# Altium project ANE_0002_01AA.PrjPCB (part 1 of 4)
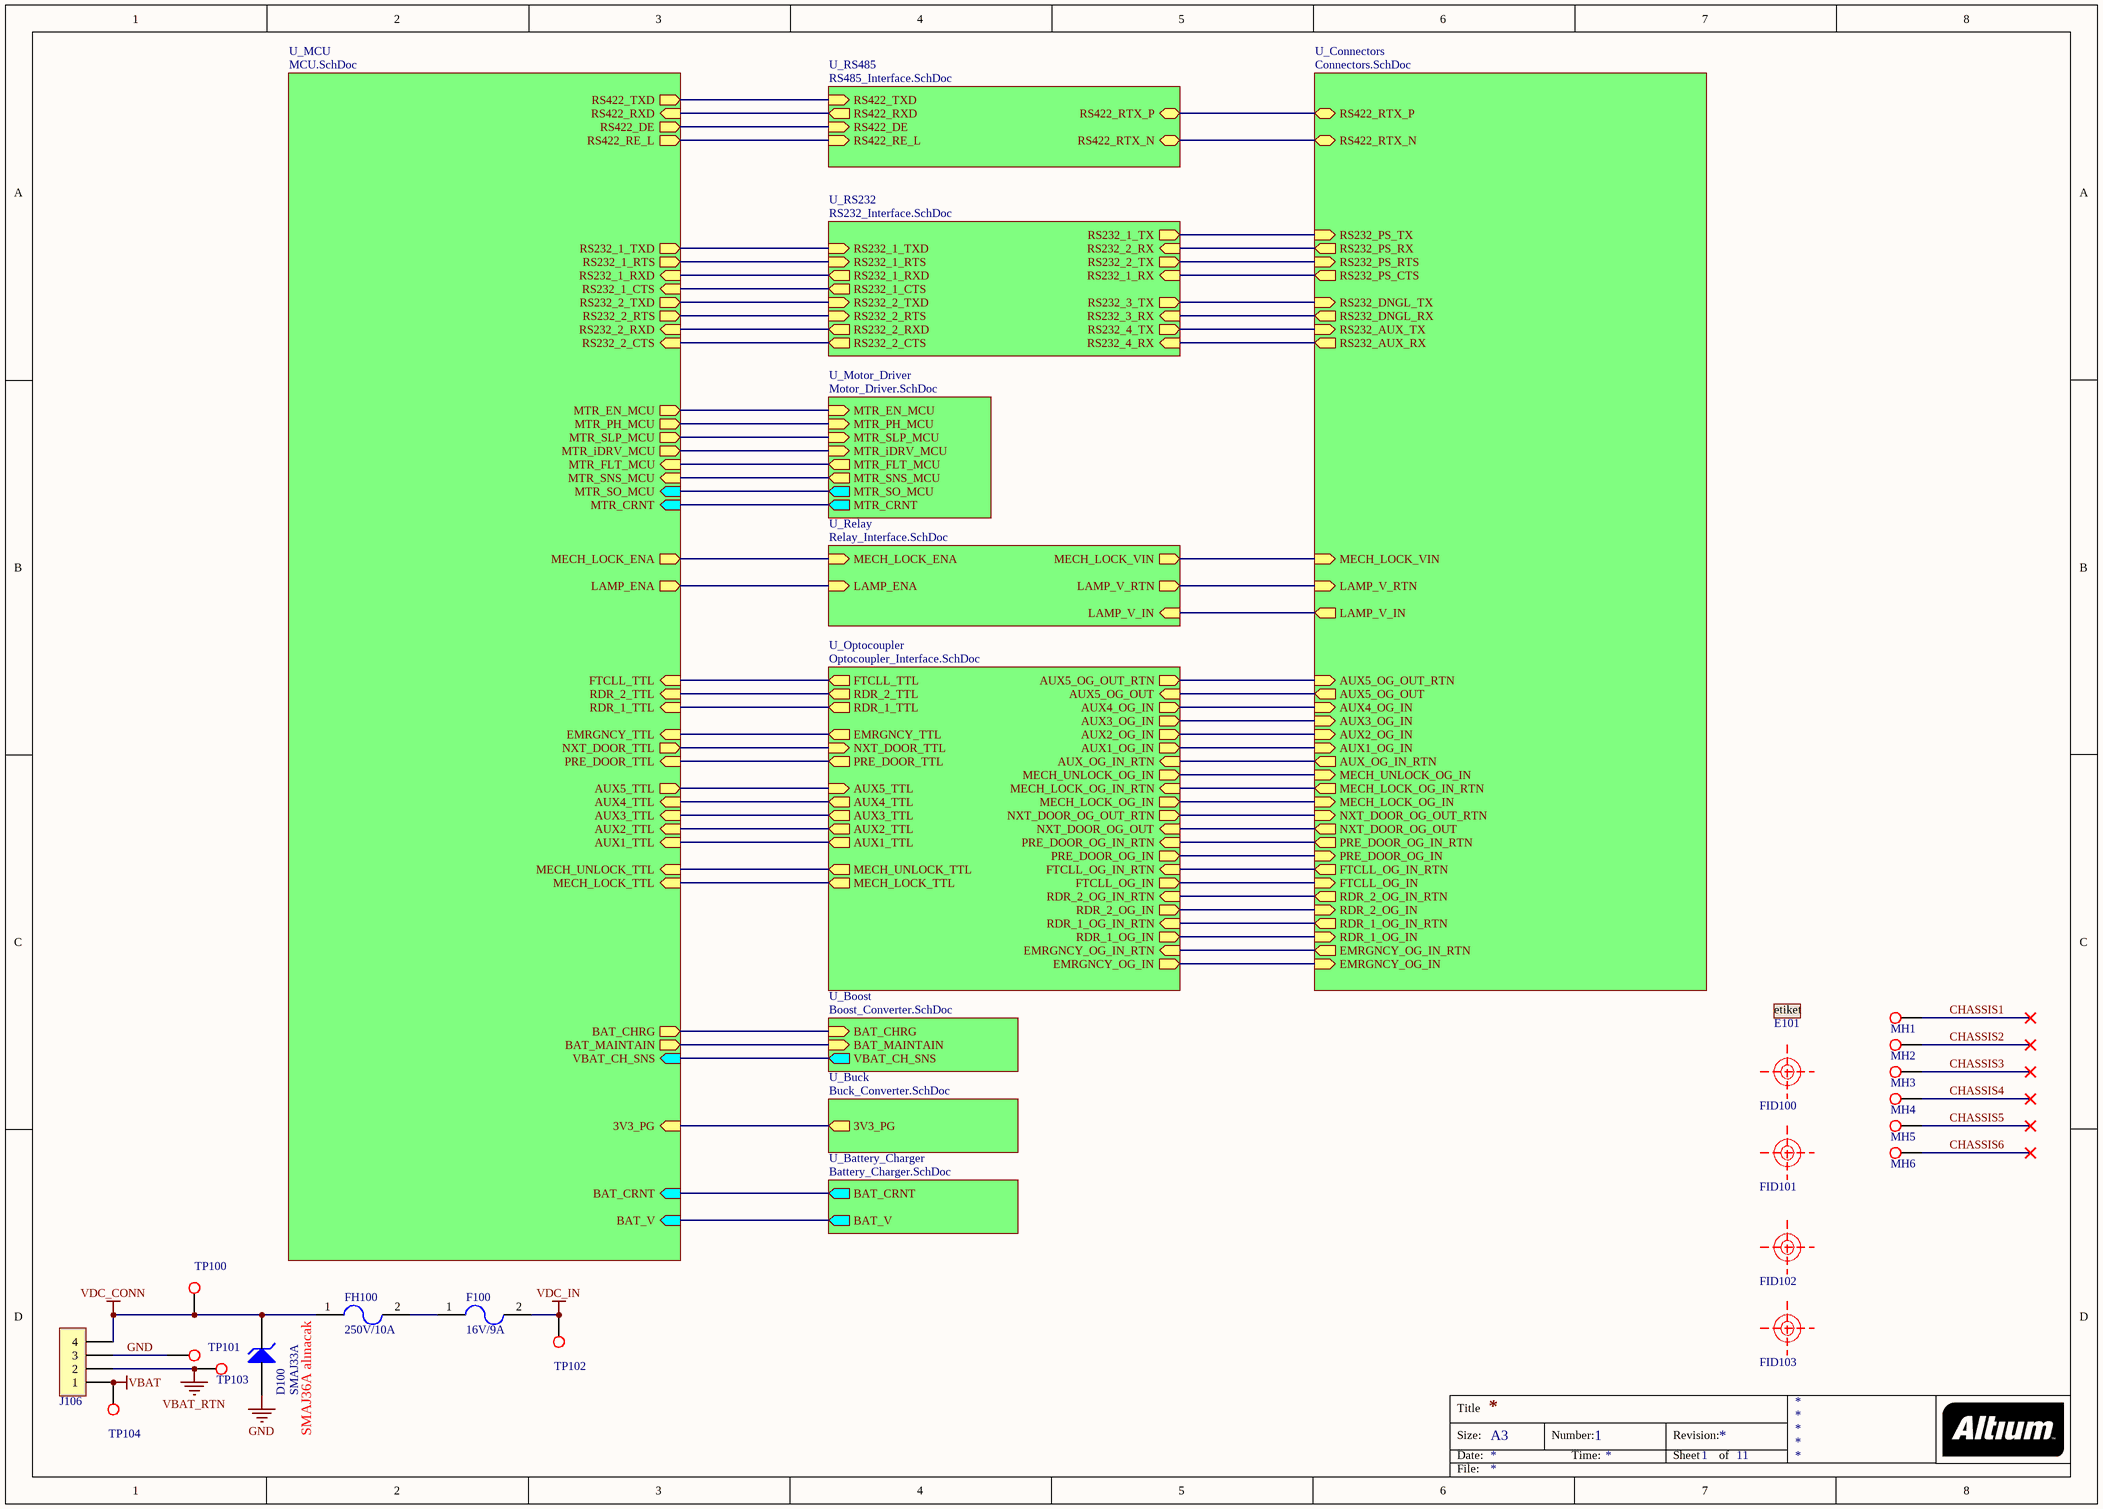
[diagram p0: Main.SchDoc]
PCBDegisiklikTarihi: 20.09.2013; Ortam: Altium Designer 13.2.5; OlusturmaTarihi: 08.11.2013; KullanilanDil: TR; GizlilikSinifi: HÝZMETE ÖZEL; DegistirmeTarihi: 21.01.2014; DegisiklikNumarasi: AC; Bolum: Artron/Donaným; ArtronProjeNumarasi: AB00-0006-01AC-0000
11 sheets, 376 parts. Net scope: hierarchical (ports join the sheet entries above them; power ports are global).
Board file: ANE_0002_01AA_0000.PcbDoc
Sheets:
  Main.SchDoc
    U_Motor_Driver = Motor_Driver.SchDoc
    U_RS232 = RS232_Interface.SchDoc
    U_RS485 = RS485_Interface.SchDoc
    U_Optocoupler = Optocoupler_Interface.SchDoc
    U_MCU = MCU.SchDoc
    U_Relay = Relay_Interface.SchDoc
    U_Boost = Boost_Converter.SchDoc
    U_Buck = Buck_Converter.SchDoc
    U_Connectors = Connectors.SchDoc
    U_Battery_Charger = Battery_Charger.SchDoc

## Sheet Main.SchDoc
size A3; DocumentNumber: 1; SheetNumber: 1; SheetTotal: 11

### Parts
D100  SMAJ33A  [DIOM5226X23N]
E101  14x07 mm  [AEME-1407-0000-N000]  (value not drawn)
F100  16V/9A  [AE12-000M-T000-9090]
FH100  250V/10A  [AE15-000T-0000-0001]
FID100  Fiducial  [FIDUCIAL_R1MM0]  (value not drawn)
FID101  Fiducial  [FIDUCIAL_R1MM0]  (value not drawn)
FID102  Fiducial  [FIDUCIAL_R1MM0]  (value not drawn)
FID103  Fiducial  [FIDUCIAL_R1MM0]  (value not drawn)
J106  (no value)  [AJ61-1004-TAPR-RNS0]
MH1  AEMT-C00S-1000-0000  [TP100]  (value not drawn)
MH2  AEMT-C00S-1000-0000  [TP100]  (value not drawn)
MH3  AEMT-C00S-1000-0000  [TP100]  (value not drawn)
MH4  AEMT-C00S-1000-0000  [TP100]  (value not drawn)
MH5  AEMT-C00S-1000-0000  [TP100]  (value not drawn)
MH6  AEMT-C00S-1000-0000  [TP100]  (value not drawn)
TP100  AEMT-C00S-1000-0000  [TP100]  (value not drawn)
TP101  AEMT-C00S-1000-0000  [TP100]  (value not drawn)
TP102  AEMT-C00S-1000-0000  [TP100]  (value not drawn)
TP103  AEMT-C00S-1000-0000  [TP100]  (value not drawn)
TP104  AEMT-C00S-1000-0000  [TP100]  (value not drawn)

### Sub-sheets
U_Battery_Charger = Battery_Charger.SchDoc: BAT_CRNT (out), BAT_V (out)
U_Boost = Boost_Converter.SchDoc: BAT_CHRG (in), BAT_MAINTAIN (in), VBAT_CH_SNS (out)
U_Buck = Buck_Converter.SchDoc: 3V3_PG (out)
U_Connectors = Connectors.SchDoc: RS232_DNGL_TX (in), RS232_DNGL_RX (out), RS232_PS_TX (in), RS232_PS_RX (out), RS232_PS_CTS (out), RS232_PS_RTS (in), MECH_LOCK_VIN (in), MECH_LOCK_OG_IN (in), MECH_LOCK_OG_IN_RTN (out), MECH_UNLOCK_OG_IN (in), EMRGNCY_OG_IN (in), EMRGNCY_OG_IN_RTN (out), PRE_DOOR_OG_IN (in), PRE_DOOR_OG_IN_RTN (out), NXT_DOOR_OG_OUT (out), NXT_DOOR_OG_OUT_RTN (in), RDR_1_OG_IN (in), RDR_1_OG_IN_RTN (out), RDR_2_OG_IN (in), RDR_2_OG_IN_RTN (out), FTCLL_OG_IN (in), FTCLL_OG_IN_RTN (out), LAMP_V_RTN (in), LAMP_V_IN (out), AUX1_OG_IN (in), AUX_OG_IN_RTN (out), AUX2_OG_IN (in), AUX3_OG_IN (in), AUX4_OG_IN (in), AUX5_OG_OUT (out), AUX5_OG_OUT_RTN (in), RS422_RTX_P (bidir), RS422_RTX_N (bidir), RS232_AUX_TX (in), RS232_AUX_RX (out)
U_MCU = MCU.SchDoc: MECH_LOCK_ENA (out), LAMP_ENA (out), EMRGNCY_TTL (in), RDR_1_TTL (in), RDR_2_TTL (in), FTCLL_TTL (in), AUX1_TTL (in), AUX2_TTL (in), AUX3_TTL (in), PRE_DOOR_TTL (in), NXT_DOOR_TTL (out), MECH_LOCK_TTL (in), MECH_UNLOCK_TTL (in), AUX4_TTL (in), AUX5_TTL (out), MTR_EN_MCU (out), MTR_PH_MCU (out), MTR_SLP_MCU (out), MTR_iDRV_MCU (out), MTR_FLT_MCU (in), MTR_SNS_MCU (in), MTR_SO_MCU (in), MTR_CRNT (in), RS232_1_TXD (out), RS232_1_RTS (out), RS232_1_RXD (in), RS232_1_CTS (in), RS422_TXD (out), RS422_RXD (in), RS422_DE (out), RS422_RE_L (out), BAT_CHRG (out), BAT_MAINTAIN (out), VBAT_CH_SNS (in), BAT_CRNT (in), BAT_V (in), 3V3_PG (in), RS232_2_CTS (in), RS232_2_RXD (in), RS232_2_RTS (out), RS232_2_TXD (out)
U_Motor_Driver = Motor_Driver.SchDoc: MTR_EN_MCU (in), MTR_PH_MCU (in), MTR_SLP_MCU (in), MTR_iDRV_MCU (in), MTR_FLT_MCU (out), MTR_SNS_MCU (out), MTR_SO_MCU (out), MTR_CRNT (out)
U_Optocoupler = Optocoupler_Interface.SchDoc: EMRGNCY_OG_IN (out), EMRGNCY_OG_IN_RTN (in), RDR_1_OG_IN (out), RDR_1_OG_IN_RTN (in), RDR_2_OG_IN (out), RDR_2_OG_IN_RTN (in), FTCLL_OG_IN (out), FTCLL_OG_IN_RTN (in), PRE_DOOR_OG_IN (out), PRE_DOOR_OG_IN_RTN (in), NXT_DOOR_OG_OUT (in), NXT_DOOR_OG_OUT_RTN (out), MECH_LOCK_OG_IN (out), MECH_LOCK_OG_IN_RTN (in), PRE_DOOR_TTL (out), NXT_DOOR_TTL (in), MECH_LOCK_TTL (out), EMRGNCY_TTL (out), RDR_1_TTL (out), RDR_2_TTL (out), FTCLL_TTL (out), MECH_UNLOCK_OG_IN (out), MECH_UNLOCK_TTL (out), AUX1_OG_IN (out), AUX_OG_IN_RTN (in), AUX1_TTL (out), AUX2_OG_IN (out), AUX2_TTL (out), AUX3_OG_IN (out), AUX3_TTL (out), AUX4_OG_IN (out), AUX4_TTL (out), AUX5_OG_OUT (in), AUX5_OG_OUT_RTN (out), AUX5_TTL (in)
U_Relay = Relay_Interface.SchDoc: MECH_LOCK_VIN (out), MECH_LOCK_ENA (in), LAMP_V_RTN (out), LAMP_ENA (in), LAMP_V_IN (in)
U_RS232 = RS232_Interface.SchDoc: RS232_1_TX (out), RS232_2_TX (out), RS232_1_RX (in), RS232_2_RX (in), RS232_1_TXD (in), RS232_1_RTS (in), RS232_1_RXD (out), RS232_1_CTS (out), RS232_3_TX (out), RS232_4_TX (out), RS232_3_RX (in), RS232_4_RX (in), RS232_2_TXD (in), RS232_2_RTS (in), RS232_2_RXD (out), RS232_2_CTS (out)
U_RS485 = RS485_Interface.SchDoc: RS422_TXD (in), RS422_RXD (out), RS422_DE (in), RS422_RE_L (in), RS422_RTX_P (bidir), RS422_RTX_N (bidir)

### Nets
GND: D100.2(A) J106.3 TP101.1
VBAT: J106.1 TP104.1
VBAT_RTN: J106.2 TP103.1
VDC_CONN: D100.1(K) FH100.1 J106.4 TP100.1
VDC_IN: F100.2 TP102.1
3V3_PG: sheet U_MCU/3V3_PG, sheet U_Buck/3V3_PG
AUX1_OG_IN: sheet U_Optocoupler/AUX1_OG_IN, sheet U_Connectors/AUX1_OG_IN
AUX1_TTL: sheet U_Optocoupler/AUX1_TTL, sheet U_MCU/AUX1_TTL
AUX2_OG_IN: sheet U_Optocoupler/AUX2_OG_IN, sheet U_Connectors/AUX2_OG_IN
AUX2_TTL: sheet U_Optocoupler/AUX2_TTL, sheet U_MCU/AUX2_TTL
AUX3_OG_IN: sheet U_Optocoupler/AUX3_OG_IN, sheet U_Connectors/AUX3_OG_IN
AUX3_TTL: sheet U_Optocoupler/AUX3_TTL, sheet U_MCU/AUX3_TTL
AUX4_OG_IN: sheet U_Optocoupler/AUX4_OG_IN, sheet U_Connectors/AUX4_OG_IN
AUX4_TTL: sheet U_Optocoupler/AUX4_TTL, sheet U_MCU/AUX4_TTL
AUX5_TTL: sheet U_Optocoupler/AUX5_TTL, sheet U_MCU/AUX5_TTL
AUX_OG_IN_RTN: sheet U_Optocoupler/AUX_OG_IN_RTN, sheet U_Connectors/AUX_OG_IN_RTN
BAT_CHRG: sheet U_MCU/BAT_CHRG, sheet U_Boost/BAT_CHRG
BAT_CRNT: sheet U_MCU/BAT_CRNT, sheet U_Battery_Charger/BAT_CRNT
BAT_MAINTAIN: sheet U_MCU/BAT_MAINTAIN, sheet U_Boost/BAT_MAINTAIN
BAT_V: sheet U_MCU/BAT_V, sheet U_Battery_Charger/BAT_V
CHASSIS1: MH1.1
CHASSIS2: MH2.1
CHASSIS3: MH3.1
CHASSIS4: MH4.1
CHASSIS5: MH5.1
CHASSIS6: MH6.1
EMRGNCY_OG_IN: sheet U_Optocoupler/EMRGNCY_OG_IN, sheet U_Connectors/EMRGNCY_OG_IN
EMRGNCY_TTL: sheet U_Optocoupler/EMRGNCY_TTL, sheet U_MCU/EMRGNCY_TTL
FTCLL_OG_IN: sheet U_Optocoupler/FTCLL_OG_IN, sheet U_Connectors/FTCLL_OG_IN
FTCLL_TTL: sheet U_Optocoupler/FTCLL_TTL, sheet U_MCU/FTCLL_TTL
LAMP_ENA: sheet U_MCU/LAMP_ENA, sheet U_Relay/LAMP_ENA
MECH_LOCK_ENA: sheet U_MCU/MECH_LOCK_ENA, sheet U_Relay/MECH_LOCK_ENA
MECH_LOCK_TTL: sheet U_Optocoupler/MECH_LOCK_TTL, sheet U_MCU/MECH_LOCK_TTL
MECH_UNLOCK_OG_IN: sheet U_Optocoupler/MECH_UNLOCK_OG_IN, sheet U_Connectors/MECH_UNLOCK_OG_IN
MECH_UNLOCK_TTL: sheet U_Optocoupler/MECH_UNLOCK_TTL, sheet U_MCU/MECH_UNLOCK_TTL
MTR_CRNT: sheet U_Motor_Driver/MTR_CRNT, sheet U_MCU/MTR_CRNT
MTR_EN_MCU: sheet U_Motor_Driver/MTR_EN_MCU, sheet U_MCU/MTR_EN_MCU
MTR_FLT_MCU: sheet U_Motor_Driver/MTR_FLT_MCU, sheet U_MCU/MTR_FLT_MCU
MTR_iDRV_MCU: sheet U_Motor_Driver/MTR_iDRV_MCU, sheet U_MCU/MTR_iDRV_MCU
MTR_PH_MCU: sheet U_Motor_Driver/MTR_PH_MCU, sheet U_MCU/MTR_PH_MCU
MTR_SLP_MCU: sheet U_Motor_Driver/MTR_SLP_MCU, sheet U_MCU/MTR_SLP_MCU
MTR_SNS_MCU: sheet U_Motor_Driver/MTR_SNS_MCU, sheet U_MCU/MTR_SNS_MCU
MTR_SO_MCU: sheet U_Motor_Driver/MTR_SO_MCU, sheet U_MCU/MTR_SO_MCU
NXT_DOOR_TTL: sheet U_Optocoupler/NXT_DOOR_TTL, sheet U_MCU/NXT_DOOR_TTL
PRE_DOOR_OG_IN: sheet U_Optocoupler/PRE_DOOR_OG_IN, sheet U_Connectors/PRE_DOOR_OG_IN
PRE_DOOR_TTL: sheet U_Optocoupler/PRE_DOOR_TTL, sheet U_MCU/PRE_DOOR_TTL
RDR_1_OG_IN: sheet U_Optocoupler/RDR_1_OG_IN, sheet U_Connectors/RDR_1_OG_IN
RDR_1_TTL: sheet U_Optocoupler/RDR_1_TTL, sheet U_MCU/RDR_1_TTL
RDR_2_OG_IN: sheet U_Optocoupler/RDR_2_OG_IN, sheet U_Connectors/RDR_2_OG_IN
RDR_2_TTL: sheet U_Optocoupler/RDR_2_TTL, sheet U_MCU/RDR_2_TTL
RS232_1_CTS: sheet U_RS232/RS232_1_CTS, sheet U_MCU/RS232_1_CTS
RS232_1_RTS: sheet U_RS232/RS232_1_RTS, sheet U_MCU/RS232_1_RTS
RS232_1_RX: sheet U_RS232/RS232_1_RX, sheet U_Connectors/RS232_PS_CTS
RS232_1_RXD: sheet U_RS232/RS232_1_RXD, sheet U_MCU/RS232_1_RXD
RS232_1_TX: sheet U_RS232/RS232_1_TX, sheet U_Connectors/RS232_PS_TX
RS232_1_TXD: sheet U_RS232/RS232_1_TXD, sheet U_MCU/RS232_1_TXD
RS232_2_CTS: sheet U_RS232/RS232_2_CTS, sheet U_MCU/RS232_2_CTS
RS232_2_RTS: sheet U_RS232/RS232_2_RTS, sheet U_MCU/RS232_2_RTS
RS232_2_RX: sheet U_RS232/RS232_2_RX, sheet U_Connectors/RS232_PS_RX
RS232_2_RXD: sheet U_RS232/RS232_2_RXD, sheet U_MCU/RS232_2_RXD
RS232_2_TX: sheet U_RS232/RS232_2_TX, sheet U_Connectors/RS232_PS_RTS
RS232_2_TXD: sheet U_RS232/RS232_2_TXD, sheet U_MCU/RS232_2_TXD
RS232_3_RX: sheet U_RS232/RS232_3_RX, sheet U_Connectors/RS232_DNGL_RX
RS232_3_TX: sheet U_RS232/RS232_3_TX, sheet U_Connectors/RS232_DNGL_TX
RS232_4_RX: sheet U_RS232/RS232_4_RX, sheet U_Connectors/RS232_AUX_RX
RS232_4_TX: sheet U_RS232/RS232_4_TX, sheet U_Connectors/RS232_AUX_TX
RS422_DE: sheet U_RS485/RS422_DE, sheet U_MCU/RS422_DE
RS422_RE_L: sheet U_RS485/RS422_RE_L, sheet U_MCU/RS422_RE_L
RS422_RTX_N: sheet U_RS485/RS422_RTX_N, sheet U_Connectors/RS422_RTX_N
RS422_RTX_P: sheet U_RS485/RS422_RTX_P, sheet U_Connectors/RS422_RTX_P
RS422_RXD: sheet U_RS485/RS422_RXD, sheet U_MCU/RS422_RXD
RS422_TXD: sheet U_RS485/RS422_TXD, sheet U_MCU/RS422_TXD
VBAT_CH_SNS: sheet U_MCU/VBAT_CH_SNS, sheet U_Boost/VBAT_CH_SNS
NetD503_3: sheet U_Optocoupler/MECH_LOCK_OG_IN, sheet U_Connectors/MECH_LOCK_OG_IN
NetF100_1: F100.1 FH100.2
NetJ100_2: sheet U_Optocoupler/FTCLL_OG_IN_RTN, sheet U_Connectors/FTCLL_OG_IN_RTN
NetJ100_5: sheet U_Optocoupler/RDR_1_OG_IN_RTN, sheet U_Connectors/RDR_1_OG_IN_RTN
NetJ100_8: sheet U_Optocoupler/RDR_2_OG_IN_RTN, sheet U_Connectors/RDR_2_OG_IN_RTN
NetJ101_1: sheet U_Relay/LAMP_V_IN, sheet U_Connectors/LAMP_V_IN
NetJ101_2: sheet U_Relay/LAMP_V_RTN, sheet U_Connectors/LAMP_V_RTN
NetJ101_9: sheet U_Optocoupler/AUX5_OG_OUT_RTN, sheet U_Connectors/AUX5_OG_OUT_RTN
NetJ101_10: sheet U_Optocoupler/AUX5_OG_OUT, sheet U_Connectors/AUX5_OG_OUT
NetJ102_1: sheet U_Relay/MECH_LOCK_VIN, sheet U_Connectors/MECH_LOCK_VIN
NetJ102_4: sheet U_Optocoupler/MECH_LOCK_OG_IN_RTN, sheet U_Connectors/MECH_LOCK_OG_IN_RTN
NetJ102_7: sheet U_Optocoupler/EMRGNCY_OG_IN_RTN, sheet U_Connectors/EMRGNCY_OG_IN_RTN
NetJ102_9: sheet U_Optocoupler/PRE_DOOR_OG_IN_RTN, sheet U_Connectors/PRE_DOOR_OG_IN_RTN
NetJ102_10: sheet U_Optocoupler/NXT_DOOR_OG_OUT_RTN, sheet U_Connectors/NXT_DOOR_OG_OUT_RTN
NetJ102_11: sheet U_Optocoupler/NXT_DOOR_OG_OUT, sheet U_Connectors/NXT_DOOR_OG_OUT

### Notes on the sheet
- SMAJ36A alınacak
- Title
- Size:
- Date:
- A3
- Number:
- Time:
- Revision:
- Sheet
- of
- File:
- (in symbol AEME-1407-0000-N000) etiket

### Library data of the parts
D100 = AS1H-975M-SI60-0001: Diode, TVS, 3.5V @35A, 33V, 400W,  Uni-directional, DO-214AC; Manufacturer Part Number: SMAJ33A-13-F; Manufacturer: Diodes; CR: 000065/122; DS: 000065; Lead Finish: Pb Free; Published by: MU; Requested by: NK; Price: *; Definition Date: 22.03.2013; Footprint Type: SMD; JEDEC Code: *; Operating Temp: -55 to 150 C; Package Reference: DO-214AC; Revision Date: *; Status: Active; Storage Temp: -55 to 175 C; Supplier: *; Supplier Part Number: *; Component Type: DIODE; Forward Voltage: 3.5V @35A; Reverse Voltage: 33 V; Value: SMAJ33A
E101 = AEME-1407-0000-N000: PCB Label, 14x07mm, Non-Conductive; Boyut: 14x07 mm
F100 = AE12-000M-T000-9090: Resettable Fuse, 16V, 9A, TH, Radial; Manufacturer: Littlefuse; Manufacturer Part Number: 16R900GF; Published By: NK; CR: *; DS: -; Definition Date: 03.08.2015; Operating Temp: -40 °C to +85 °C; Footprint Type: TH; Revision: *; Revision Date: -; Lead Finish: *; Status: Active; Storage Temp: -40 °C to +85 °C; Component Type: Fuse; JEDEC Code: *; Package Reference: -; Price: *; Requested By: NK; Supplier: *; Supplier Part Number: *; Current Rating: 9A; Max. Operating Voltage: 16V; Value: 16V/9A
FH100 = AE15-000T-0000-0001: Fuse block, TH, 5x20mm; Manufacturer: Littlefuse; Manufacturer Part Number: 65600001009; Published By: NK; Current Rating: 10; Max. Operating Voltage: 250V; CR: *; DS: -; Definition Date: 08.08.2015; Operating Temp: -40 °C to +85 °C; Footprint Type: TH; Revision: *; Revision Date: -; Lead Finish: *; Status: Active; Storage Temp: -40 °C to +85 °C; Component Type: Fuse; JEDEC Code: *; Package Reference: -; Price: *; Requested By: NK; Supplier: *; Supplier Part Number: *; Value: 250V/10A
FID100-FID103 = FIDUCIAL_R1MM0: Fiducial, Round, 1mm; Published By: MAY; Definition Date: 24.05.2012; Height: 0; Revision: 0; Component Type: Fiducial
J106 = AJ61-1004-TAPR-RNS0: CON, Terminal, Klemens, 4 Pins, 1-Row, 5.08mm, TH, P, R; Manufacturer: ON-SHORE; Manufacturer Part Number: OSTOQ045451; Requested by: NK; Lead Finish: Pb Free; Max. Operating Voltage: 250VAC; Rated Current: 15A; CR: -; Definition Date: 11.08.2015; Revision Date: *; Price: *; Supplier: *; Supplier Part Number: *; DS: -; Operating Temp: -30, +105; Storage Temp: -30, +105; Status: Active; Package Reference: *; Component Type: Connector; Footprint Type: TH; Published by: NK; JEDEC Code: *; Material: *
MH1-MH6 TP100-TP104 = AEMT-C00S-1000-0000: Test Point, Circular, 1mm; Text: TEST_POINT

## Sheet Motor_Driver.SchDoc
size A3; DocumentNumber: 2; SheetNumber: 2; SheetTotal: 11
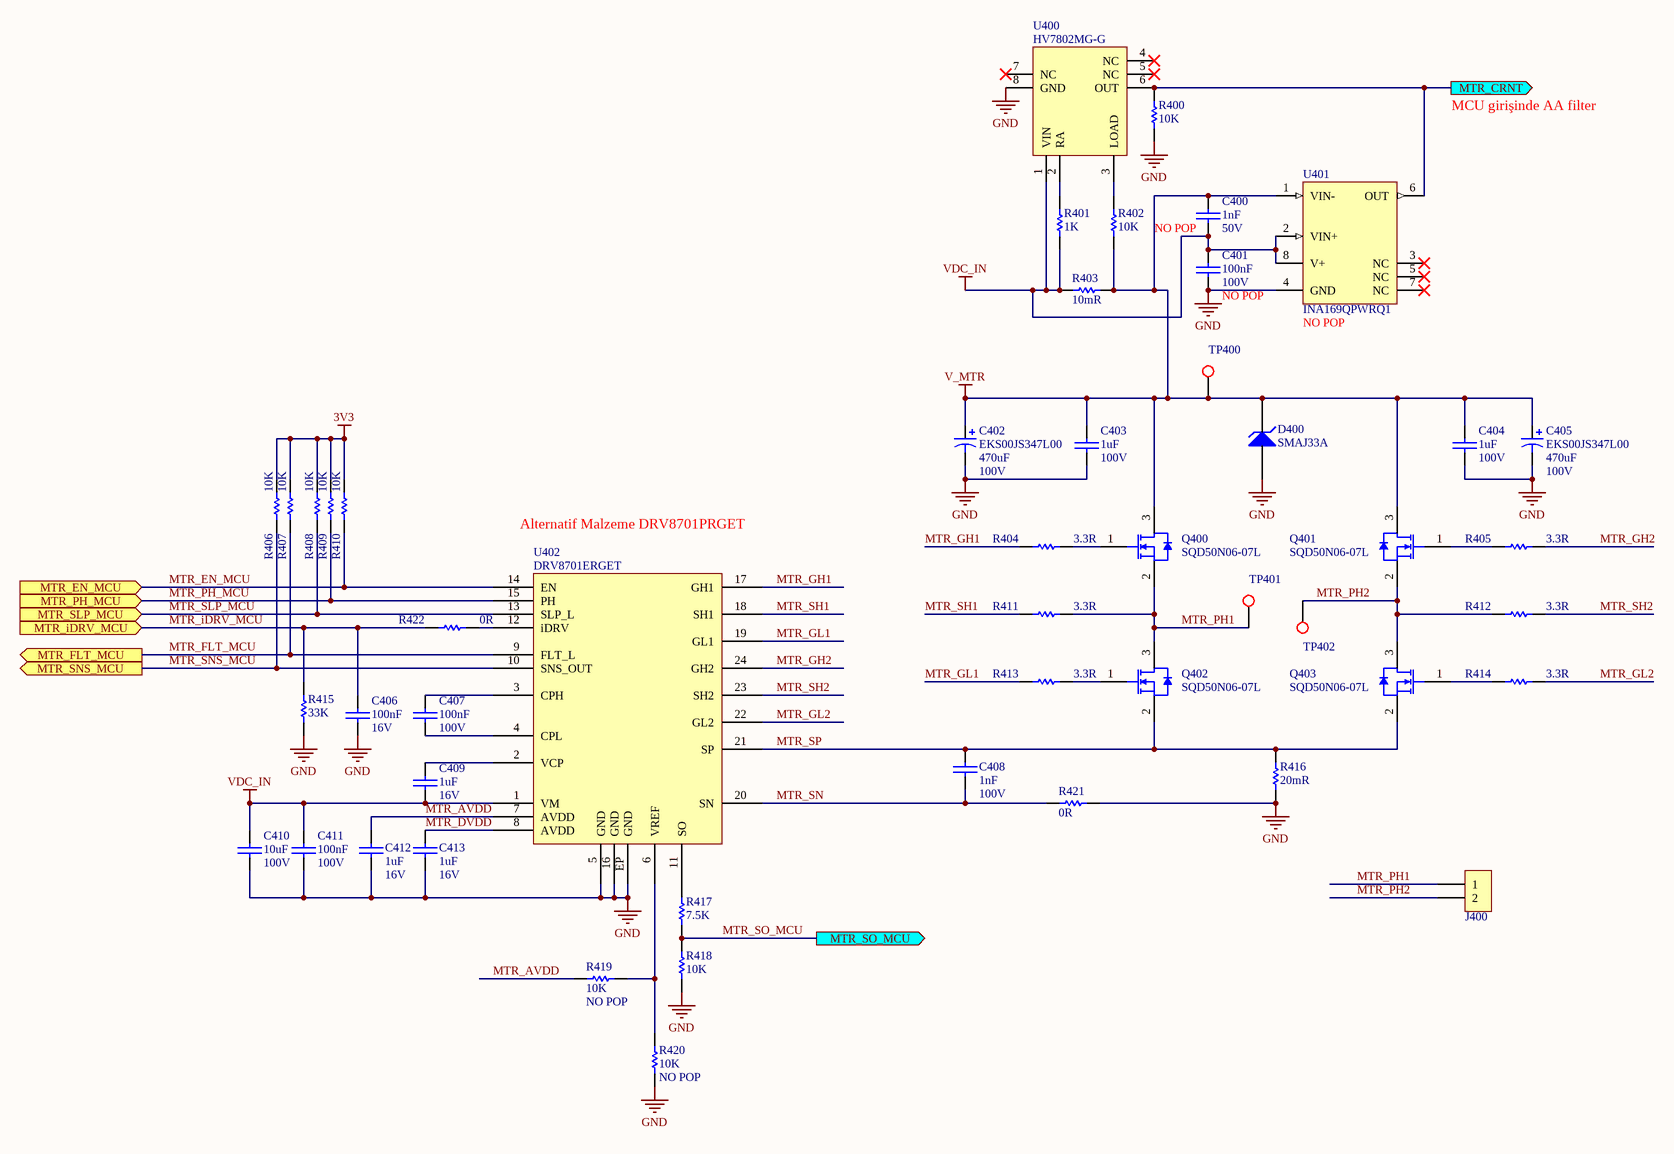
[diagram p1: Motor_Driver.SchDoc]

### Parts
C400  Operating Voltage: 50V  Assembly: NO POP  [CAPC1005X06N]  (hidden comment: 1nF)
C401  Operating Voltage: 100V  Assembly: NO POP  [CAPC3216X09N]  (hidden comment: 100nF)
C402  EKS00JS347L00  value 470uF  Rated Voltage: 100V  [CAPPR7.5-16X31.5]
C403  Operating Voltage: 100V  [CAPC3216X09N]  (hidden comment: 1uF)
C404  Operating Voltage: 100V  [CAPC3216X09N]  (hidden comment: 1uF)
C405  EKS00JS347L00  value 470uF  Rated Voltage: 100V  [CAPPR7.5-16X31.5]
C406  Operating Voltage: 16V  [CAPC1005X06N]  (hidden comment: 100nF)
C407  Operating Voltage: 100V  [CAPC3216X09N]  (hidden comment: 100nF)
C408  Operating Voltage: 100V  [CAPC1608X09N]  (hidden comment: 1nF)
C409  Operating Voltage: 16V  [CAPC2012X14N]  (hidden comment: 1uF)
C410  Operating Voltage: 100V  [CAPC5750X25N]  (hidden comment: 10uF)
C411  Operating Voltage: 100V  [CAPC3216X09N]  (hidden comment: 100nF)
C412  Operating Voltage: 16V  [CAPC2012X14N]  (hidden comment: 1uF)
C413  Operating Voltage: 16V  [CAPC2012X14N]  (hidden comment: 1uF)
D400  SMAJ33A  [DIOM5226X23N]
J400  (no value)  [AJ61-1002-TAPR-RNS0]
Q400  SQD50N06-07L  [TO228P970-3N]
Q401  SQD50N06-07L  [TO228P970-3N]
Q402  SQD50N06-07L  [TO228P970-3N]
Q403  SQD50N06-07L  [TO228P970-3N]
R400  10K  [RESC1005X04N]
R401  1K  [RESC1005X04N]
R402  10K  [RESC1005X04N]
R403  10mR  [RESC3216X08N]
R404  3.3R  [RESC2012X07N]
R405  3.3R  [RESC2012X07N]
R406  10K  [RESC1005X04N]
R407  10K  [RESC1005X04N]
R408  10K  [RESC1005X04N]
R409  10K  [RESC1005X04N]
R410  10K  [RESC1005X04N]
R411  3.3R  [RESC2012X07N]
R412  3.3R  [RESC2012X07N]
R413  3.3R  [RESC2012X07N]
R414  3.3R  [RESC2012X07N]
R415  33K  [RESC1005X04N]
R416  20mR  [RESC3216X08N]
R417  7.5K  [RESC1005X04N]
R418  10K  [RESC1005X04N]
R419  Assembly: NO POP  [RESC1005X04N]  (hidden comment: 10K)
R420  Assembly: NO POP  [RESC1005X04N]  (hidden comment: 10K)
R421  0R  [RESC2012X07N]
R422  0R  [RESC1005X04N]
TP400  AEMT-C00S-1000-0000  [TP100]  (value not drawn)
TP401  AEMT-C00S-1000-0000  [TP100]  (value not drawn)
TP402  AEMT-C00S-1000-0000  [TP100]  (value not drawn)
U400  HV7802MG-G  [MSOP65P490X110-8N]
U401  Assembly: NO POP  [TSOP65P640X120-8N]  (hidden comment: INA169QPWRQ1)
U402  DRV8701ERGET  [QFN50P400X400X100_HS-25N]

### Ports
MTR_CRNT (out), MTR_EN_MCU (in), MTR_FLT_MCU (out), MTR_iDRV_MCU (in), MTR_PH_MCU (in), MTR_SLP_MCU (in), MTR_SNS_MCU (out), MTR_SO_MCU (out)

### Nets
3V3: R406.2 R407.2 R408.2 R409.2 R410.2
GND: C401.1 C402.2 C403.1 C404.1 C405.2 C406.1 C410.1 C411.1 C412.1 C413.1 D400.2(A) R400.1 R415.1 R416.1 R418.2 R420.1 R421.2 U400.8(GND) U401.4(GND) U402.5(GND) U402.16(GND) U402.EP(GND)
V_MTR: C400.2 C402.1 C403.2 C404.2 C405.1 D400.1(K) Q400.3(Drain) Q401.3(Drain) R402.1 R403.2 TP400.1 U401.1(VIN-)
VDC_IN: C400.1 C401.2 C409.1 C410.2 C411.2 R401.1 R403.1 U400.1(VIN) U401.2(VIN+) U401.8(V+) U402.1(VM)
MTR_AVDD: C412.2 R419.2 U402.7(AVDD)
MTR_CRNT: R400.2 U400.6(OUT) U401.6(OUT) ; port MTR_CRNT
MTR_DVDD: C413.2 U402.8(AVDD)
MTR_EN_MCU: R410.1 U402.14(EN) ; port MTR_EN_MCU
MTR_FLT_MCU: R407.1 U402.9(FLT_L) ; port MTR_FLT_MCU
MTR_GH1: R404.1 U402.17(GH1)
MTR_GH2: R405.2 U402.24(GH2)
MTR_GL1: R413.1 U402.19(GL1)
MTR_GL2: R414.2 U402.22(GL2)
MTR_iDRV_MCU: C406.2 R415.2 R422.1 ; port MTR_iDRV_MCU
MTR_PH1: J400.1 Q400.2(Source) Q402.3(Drain) R411.2 TP401.1
MTR_PH2: J400.2 Q401.2(Source) Q403.3(Drain) R412.1 TP402.1
MTR_PH_MCU: R409.1 U402.15(PH) ; port MTR_PH_MCU
MTR_SH1: R411.1 U402.18(SH1)
MTR_SH2: R412.2 U402.23(SH2)
MTR_SLP_MCU: R408.1 U402.13(SLP_L) ; port MTR_SLP_MCU
MTR_SN: C408.1 R421.1 U402.20(SN)
MTR_SNS_MCU: R406.1 U402.10(SNS_OUT) ; port MTR_SNS_MCU
MTR_SO_MCU: R417.1 R418.1 ; port MTR_SO_MCU
MTR_SP: C408.2 Q402.2(Source) Q403.2(Source) R416.2 U402.21(SP)
NetC407_1: C407.1 U402.4(CPL)
NetC407_2: C407.2 U402.3(CPH)
NetC409_2: C409.2 U402.2(VCP)
NetQ400_1: Q400.1(Gate) R404.2
NetQ401_1: Q401.1(Gate) R405.1
NetQ402_1: Q402.1(Gate) R413.2
NetQ403_1: Q403.1(Gate) R414.1
NetR401_2: R401.2 U400.2(RA)
NetR402_2: R402.2 U400.3(LOAD)
NetR417_2: R417.2 U402.11(SO)
NetR419_1: R419.1 R420.2 U402.6(VREF)
NetR422_2: R422.2 U402.12(iDRV)

Not connected (* = marked no-connect by the designer): U400 4(NC)* 5(NC)* 7(NC)*; U401 3(NC)* 5(NC)* 7(NC)*

### Notes on the sheet
- MCU girişinde AA filter
- Alternatif Malzeme DRV8701PRGET
- Title
- Size:
- Date:
- A3
- Number:
- Time:
- Revision:
- Sheet
- of
- File:

### Library data of the parts
C400 = ACC0-0100-S272-0000: CAP, CER, C0G, 1nF, %5, 50V, 0402; Manufacturer: Murata; Manufacturer Part Number: GRM1555C1H102JA01D; CR: 000049; Requested by: MU; Lead Finish: Pb Free; Material: Ceramic, C0G; Definition Date: 14.08.2012; Revision Date: *; Price: *; Supplier: *; Supplier Part Number: *; DS: 000049; Operating Temp: -55 to 125 C; Storage Temp: -55 to 125 C; Status: Active; Package Reference: EIA 0402, Metric 1005; Component Type: Capacitor; Footprint Type: SMD; Published by: MU; ESR: *; FR: *; Value: 1nF
C401 C407 C411 = ACC7-2100-S791-0000: CAP, CER, X7R, 100nF, %10, 100V, 1206; Manufacturer: KEMET; Manufacturer Part Number: C1206C104K1RACTU; CR: 000211/89; Requested by: OO; DS: 000211; Lead Finish: Pb Free; Published by: MU; Material: Ceramic, X7R; Definition Date: 18.02.2013; Revision Date: *; Price: *; Supplier: *; Supplier Part Number: *; Operating Temp: -55 to 125 C; Storage Temp: -55 to 125 C; Status: Active; Package Reference: EIA 1206, Metric 3216; Component Type: Capacitor; Footprint Type: SMD; ESR: *; FR: *; Value: 100nF
C402 C405 = EKS00JS347L00: Aluminum Electrolytic Capacitor, Radial Style with Long Leads: 470uF, 100V; Note: Refer to Manufacturer's Data Sheets for other lead formations; DrillSize: Nominal, Rounded To The Nearest 0.1mm; Published: 19-Mar-2004; DatasheetDocument: 30-May-2000; PackageReference: CAPPR7.5-16X31.5; Publisher: Altium Limited; ComponentLink1Description: Manufacturer Link; ComponentLink1URL: http://www.vishay.com/; ComponentLink2Description: Datasheet; ComponentLink2URL: http://www.vishay.com/docs/25007/eks.pdf
C403 C404 = ACC7-3100-S691-0000: CAP, CER, X7R, 1uF, %10, 100V, 1206; Manufacturer: Murata; Manufacturer Part Number: GRM31CR72A105KA01L; CR: 344; Requested by: NK; DS: 00049; Lead Finish: Pb Free; Published by: IS; Material: Ceramic, X7R; Definition Date: 13.02.2014; Revision Date: *; Price: *; Supplier: *; Supplier Part Number: *; Operating Temp: -55 to 125 C; Storage Temp: -55 to 125 C; Status: Active; Package Reference: EIA 1206, Metric 3216; Component Type: Capacitor; Footprint Type: SMD; ESR: *; FR: *; Value: 1uF
C406 = ACC7-2100-S241-0000: CAP, CER, X7R, 100nF, %10, 16V, 0402; Manufacturer: Murata; Manufacturer Part Number: GRM155R71C104KA88D; CR: 000049; Requested by: MU; Lead Finish: Pb Free; Material: Ceramic, X7R; Definition Date: 14.08.2012; Revision Date: *; Price: *; Supplier: *; Supplier Part Number: *; DS: 000049; Operating Temp: -55 to 125 C; Storage Temp: -55 to 125 C; Status: Active; Package Reference: EIA 0402, Metric 1005; Component Type: Capacitor; Footprint Type: SMD; Published by: MU; ESR: *; FR: *; Value: 100nF
C408 = ACC7-0100-S391-0000: CAP, CER, X7R, 1nF, %10, 100V, 0603; Manufacturer: Murata; Manufacturer Part Number: GRM188R72A102KA01D; CR: 000049; Requested by: MU; Lead Finish: Pb Free; Material: Ceramic, X7R; Definition Date: 14.08.2012; Revision Date: 25.06.2013; Price: *; Supplier: *; Supplier Part Number: *; DS: 000049; Operating Temp: -55 to 125 C; Storage Temp: -55 to 125 C; Status: Active; Package Reference: EIA 0603, Metric 1608; Component Type: Capacitor; Footprint Type: SMD; Published by: MU; ESR: *; FR: *; Value: 1nF
C409 C412 C413 = ACC7-3100-S441-0000: CAP, CER, X7R, 1uF, %10, 16V, 0805; Manufacturer: Murata; Manufacturer Part Number: GRM21BR71C105KA01L; CR: 000049; Requested by: MU; Lead Finish: Pb Free; Material: Ceramic, X7R; Definition Date: 14.08.2012; Revision Date: *; Price: *; Supplier: *; Supplier Part Number: *; DS: 000049; Operating Temp: -55 to 125 C; Storage Temp: -55 to 125 C; Status: Active; Package Reference: EIA 0805, Metric 2012; Component Type: Capacitor; Footprint Type: SMD; Published by: MU; ESR: *; FR: *; Value: 1uF
C410 = ACC4-4100-SD91-0000: CAP, CER, X7S, 10uF, %10, 100V, 2220; Manufacturer: TDK; Manufacturer Part Number: CGA9N3X7S2A106K230KB; CR: 232; Requested by: MU; DS: 000310; Lead Finish: Pb Free; Material: Ceramic, X7S; Definition Date: 23.08.2013; Revision Date: *; Price: *; Supplier: *; Supplier Part Number: *; Operating Temp: -55 to 125 C; Storage Temp: -55 to 125 C; Status: Active; Package Reference: EIA 5750, Metric 2220; Component Type: Capacitor; Footprint Type: SMD; Published by: MU; FR: *; Value: 10uF
D400 = AS1H-975M-SI60-0001: as D100 on sheet Main; Price: *; Definition Date: 22.03.2013; Footprint Type: SMD; JEDEC Code: *; Operating Temp: -55 to 150 C; Package Reference: DO-214AC; Revision Date: *; Status: Active; Storage Temp: -55 to 175 C; Supplier: *; Supplier Part Number: *; Component Type: DIODE; Forward Voltage: 3.5V @35A; Reverse Voltage: 33 V; Value: SMAJ33A
J400 = AJ61-1002-TAPR-RNS0: CON, Terminal, Klemens, 2 Pins, 1-Row, 5.08mm, TH, P, R; Manufacturer: ON-SHORE; Manufacturer Part Number: OSTOQ025451; Requested by: NK; Lead Finish: Pb Free; Max. Operating Voltage: 250VAC; Rated Current: 15A; CR: -; Definition Date: 11.08.2015; Revision Date: *; Price: *; Supplier: *; Supplier Part Number: *; DS: -; Operating Temp: -30, +105; Storage Temp: -30, +105; Status: Active; Package Reference: *; Component Type: Connector; Footprint Type: TH; Published by: NK; JEDEC Code: *; Material: *
Q400-Q403 = AS26-A50M-SI40-0000: Transistor, MOSFET, N, 60V, 50A, 7.6mR, SQD50N06-07L, TO-252; Manufacturer Part Number: SQD50N06-07L-GE3; Manufacturer: VISHAY; CR: 000207/85; DS: 000207; Lead Finish: Pb Free; Published by: MU; Requested by: MAY; Vgs(max): +-20V; Price: *; Definition Date: 18.02.2013; Footprint Type: SMD; JEDEC Code: TO-252; Operating Temp: -55 to 175 C; Package Reference: TO-252; Revision Date: *; Status: Active; Storage Temp: -55 to 175 C; Supplier: *; Supplier Part Number: *; Component Type: TRS/MOSFET; Vds(max): 60V; Id: 50A; Value: SQD50N06-07L
R400 R402 R406-R410 R418-R420 = AR19-4100-S2B2-0000: RES, E24, Thick Film, SMD, 10K, 1%, 0.1W, 0402; Manufacturer: Panasonic; Manufacturer Part Number: ERJ-2RKF1002X; CR: DS00073; Requested by: MU; Lead Finish: Pb Free; Max. Operating Voltage: 50V; Definition Date: 16.08.2012; Revision Date: *; Price: *; Supplier: *; Supplier Part Number: *; DS: DS00073; Operating Temp: -55 to 155 C; Storage Temp: -55 to 155 C; Status: Active; Package Reference: EIA 0402, Metric 1005; Component Type: Resistor; Footprint Type: SMD; Published by: MU; JEDEC Code: *; Material: Thick Film; ESR: *; FR: *; Power Rating: 0.1W; Value: 10K
R401 = AR19-3100-S2B2-0000: RES, E24, Thick Film, SMD, 1K, 1%, 0.1W, 0402; Manufacturer: Panasonic; Manufacturer Part Number: ERJ-2RKF1001X; CR: DS00073; Requested by: MU; Lead Finish: Pb Free; Max. Operating Voltage: 50V; Definition Date: 16.08.2012; Revision Date: *; Price: *; Supplier: *; Supplier Part Number: *; DS: DS00073; Operating Temp: -55 to 155 C; Storage Temp: -55 to 155 C; Status: Active; Package Reference: EIA 0402, Metric 1005; Component Type: Resistor; Footprint Type: SMD; Published by: MU; JEDEC Code: *; Material: Thick Film; ESR: *; FR: *; Power Rating: 0.1W; Value: 1K
R403 = AR19-Y100-S5D2-0000: RES, Thick Film, SMD, 10mR, 1%, 1W, 1206; Manufacturer: Panasonic; Manufacturer Part Number: ERJ-8BWFR010V; CR: 000078/95; Requested by: MU; DS: 000078; Lead Finish: Pb Free; Max. Operating Voltage: 0.40; Definition Date: 19.02.2013; Revision Date: *; Price: *; Supplier: *; Supplier Part Number: *; Operating Temp: -55 to 155 C; Storage Temp: -55 to 155 C; Status: Active; Package Reference: EIA 1206, Metric 3216; Component Type: Resistor; Footprint Type: SMD; Published by: MU; JEDEC Code: *; Material: Thick Film; ESR: *; FR: *; Power Rating: 1W; Value: 10mR
R404 R405 R411-R414 = AR19-0330-S4D2-0000: RES, E24, Thick Film, SMD, 3.3R, 1%, 0.125W, 0805; Manufacturer: Panasonic; Manufacturer Part Number: ERJ-6RQF3R3V; CR: 000201; Requested by: MAY; Lead Finish: Pb Free; Published by: MU; Definition Date: 16.02.2013; Revision Date: *; Price: *; Supplier: *; Supplier Part Number: *; DS: 000201; Operating Temp: -55 to 155 C; Storage Temp: -55 to 155 C; Status: Active; Package Reference: EIA 0805, Metric 2012; Component Type: Resistor; Footprint Type: SMD; JEDEC Code: *; Material: Thick Film; ESR: *; FR: *; Max. Operating Voltage: *; Power Rating: 0.125W; Value: 3.3R
R415 = AR19-4330-S2B2-0000: RES, E24, Thick Film, SMD, 33K, 1%, 0.1W, 0402; Manufacturer: Panasonic; Manufacturer Part Number: ERJ-2RKF3302X; CR: DS00073; Requested by: MU; Lead Finish: Pb Free; Max. Operating Voltage: 50V; Definition Date: 16.08.2012; Revision Date: *; Price: *; Supplier: *; Supplier Part Number: *; DS: DS00073; Operating Temp: -55 to 155 C; Storage Temp: -55 to 155 C; Status: Active; Package Reference: EIA 0402, Metric 1005; Component Type: Resistor; Footprint Type: SMD; Published by: MU; JEDEC Code: *; Material: Thick Film; ESR: *; FR: *; Power Rating: 0.1W; Value: 33K
R416 = AR19-Y200-S5D2-0000: RES, Thick Film, SMD, 20mR, 1%, 1W, 1206; Manufacturer: Panasonic; Manufacturer Part Number: ERJ-8BWFR020V; CR: 000078; Requested by: MU; Lead Finish: Pb Free; Max. Operating Voltage: 0.40; Definition Date: 19.02.2013/95; Revision Date: *; Price: *; Supplier: *; Supplier Part Number: *; DS: 000078; Operating Temp: -55 to 155 C; Storage Temp: -55 to 155 C; Status: Active; Package Reference: EIA 1206, Metric 3216; Component Type: Resistor; Footprint Type: SMD; Published by: MU; JEDEC Code: *; Material: Thick Film; ESR: *; FR: *; Power Rating: 1W; Value: 20mR
R417 = AR19-3750-S2B2-0000: RES, E24, Thick Film, SMD, 7.5K, 1%, 0.1W, 0402; Manufacturer: Panasonic; Manufacturer Part Number: ERJ-2RKF7501X; CR: DS00073; Requested by: MU; Lead Finish: Pb Free; Max. Operating Voltage: 50V; Definition Date: 16.08.2012; Revision Date: *; Price: *; Supplier: *; Supplier Part Number: *; DS: DS00073; Operating Temp: -55 to 155 C; Storage Temp: -55 to 155 C; Status: Active; Package Reference: EIA 0402, Metric 1005; Component Type: Resistor; Footprint Type: SMD; Published by: MU; JEDEC Code: *; Material: Thick Film; ESR: *; FR: *; Power Rating: 0.1W; Value: 7.5K
R421 = AR19-0000-S407-0000: RES, Thick Film, SMD, 0R, Jumper, 0.125W, 0805; Manufacturer: Panasonic; Manufacturer Part Number: ERJ-6GEY0R00V; CR: 000062; Requested by: MAY; Lead Finish: Pb Free; Published by: MU; Max. Operating Voltage: 150V; Definition Date: 09.11.2012; Revision Date: *; Price: *; Supplier: *; Supplier Part Number: *; DS: 000062; Operating Temp: -55 to 155 C; Storage Temp: -55 to 155 C; Status: Active; Package Reference: EIA 0805, Metric 2012; Component Type: Resistor; Footprint Type: SMD; JEDEC Code: *; Material: Thick Film; ESR: *; FR: *; Power Rating: 0.125W; Value: 0R
R422 = AR19-0000-S201-0000: RES, Thick Film, SMD, 0R, Jumper, 0.1W, 0402; Manufacturer: Panasonic; Manufacturer Part Number: ERJ-2GE0R00X; CR: 000062; Requested by: MAY; Lead Finish: Pb Free; Published by: MU; Max. Operating Voltage: 50V; Definition Date: 09.07.2012; Revision Date: *; Price: *; Supplier: *; Supplier Part Number: *; DS: 000062; Operating Temp: -55 to 155 C; Storage Temp: -55 to 155 C; Status: Active; Package Reference: EIA 0402, Metric 1005; Component Type: Resistor; Footprint Type: SMD; JEDEC Code: *; Material: Thick Film; ESR: *; FR: *; Power Rating: 0.1W; Value: 0R
TP400-TP402 = AEMT-C00S-1000-0000: as MH1 on sheet Main
U400 = AT82-0000-SMC0-1860: IC, PMIC, Current Monitor, HV7802MG-G, MSOP-8; Manufacturer: Microchip; JEDEC Code: MO-187; Lead Finish: Pb Free; Published by: NK; Component Type: IC; CR: -; Definition Date: 01.08.2015; DS: -; Footprint Type: SMD; Manufacturer Part Number: HV7802MG-G; Operating Temp: -40°C to 85°C; Package Reference: MSOP-8; Price: *; Requested by: NK; Revision Date: -; Status: Active; Storage Temp: -65°C to 150°C; Supplier: *; Supplier Part Number: *; FR: *; Value: HV7802MG-G
U401 = AT82-0000-SM90-0690: IC, PMIC, Current Monitor, INA169QPWRQ1, TSSOP-8; Manufacturer: Texas Instruments; CR: 000177; JEDEC Code: MO-153; Lead Finish: Pb Free; Published by: MU; Requested by: OO; Component Type: IC; Definition Date: 20.12.2012; DS: 000177; Footprint Type: SMD; Manufacturer Part Number: INA169QPWRQ1; Operating Temp: -40°C to 125°C; Package Reference: TSSOP-8; Price: *; Revision Date: 27.05.2013; Status: Active; Storage Temp: -65°C to 150°C; Supplier: *; Supplier Part Number: *; FR: *; Value: INA169QPWRQ1
U402 = AT8B-0000-SF60-1850: IC, PMIC, Motor Driver, PWM Input, DRV8701ERGET, PQFN-24; Manufacturer: Texas Instruments; Published by: NK; Component Type: IC; CR: -; Definition Date: 25.07.2015; DS: -; Footprint Type: SMD; Manufacturer Part Number: DRV8701ERGET; Operating Temp: -40, +125; Package Reference: PQFN-24; Requested by: NK; Status: Active

## Sheet RS232_Interface.SchDoc
size A3; DocumentNumber: 3; SheetNumber: 3; SheetTotal: 11
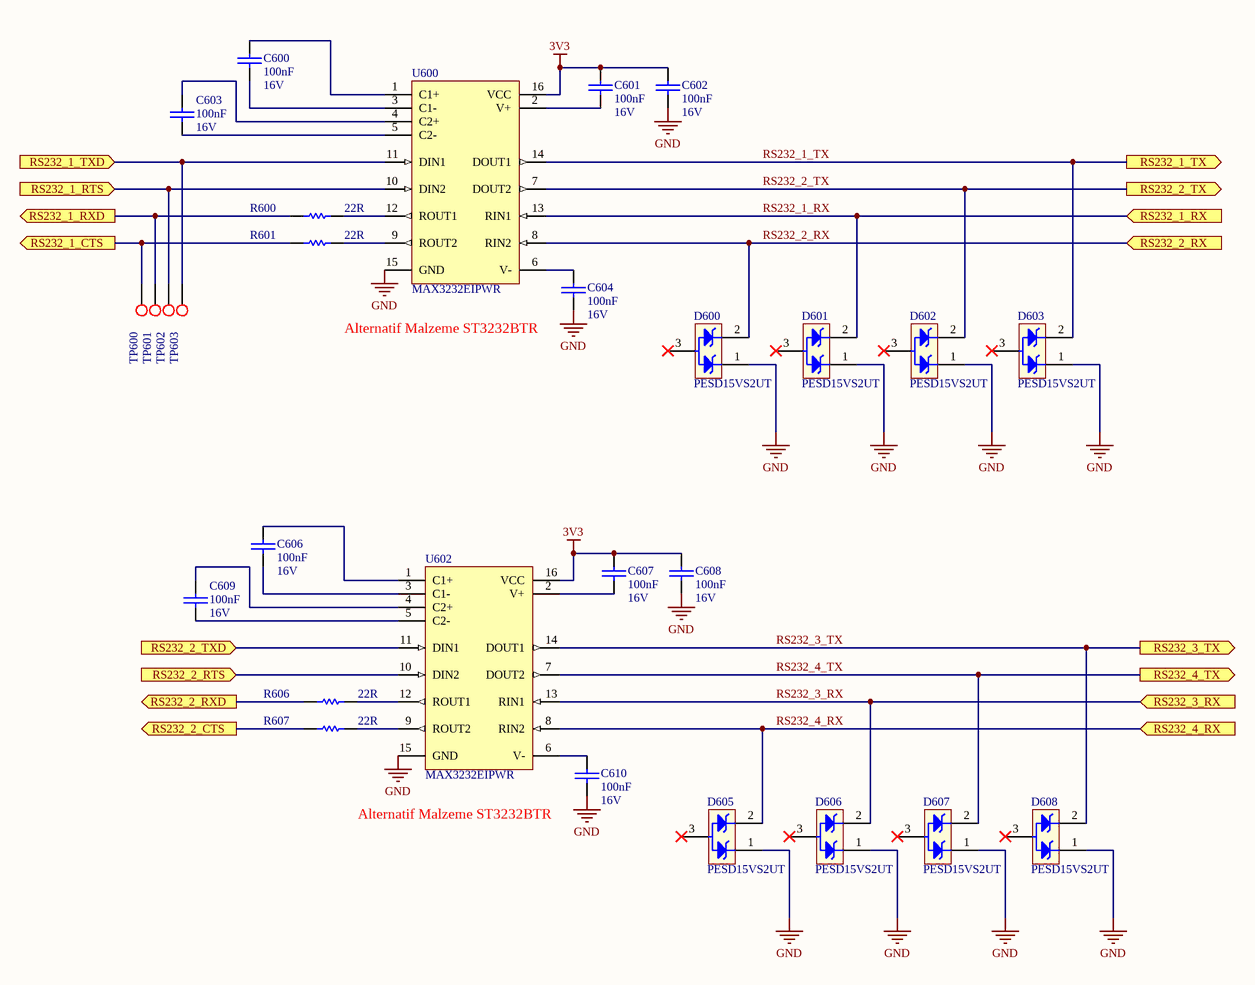
[diagram p2: RS232_Interface.SchDoc]

### Parts
C600  Operating Voltage: 16V  [CAPC1005X06N]  (hidden comment: 100nF)
C601  Operating Voltage: 16V  [CAPC1005X06N]  (hidden comment: 100nF)
C602  Operating Voltage: 16V  [CAPC1005X06N]  (hidden comment: 100nF)
C603  Operating Voltage: 16V  [CAPC1005X06N]  (hidden comment: 100nF)
C604  Operating Voltage: 16V  [CAPC1005X06N]  (hidden comment: 100nF)
C606  Operating Voltage: 16V  [CAPC1005X06N]  (hidden comment: 100nF)
C607  Operating Voltage: 16V  [CAPC1005X06N]  (hidden comment: 100nF)
C608  Operating Voltage: 16V  [CAPC1005X06N]  (hidden comment: 100nF)
C609  Operating Voltage: 16V  [CAPC1005X06N]  (hidden comment: 100nF)
C610  Operating Voltage: 16V  [CAPC1005X06N]  (hidden comment: 100nF)
D600  PESD15VS2UT  [SOT95P230X111-3N]
D601  PESD15VS2UT  [SOT95P230X111-3N]
D602  PESD15VS2UT  [SOT95P230X111-3N]
D603  PESD15VS2UT  [SOT95P230X111-3N]
D605  PESD15VS2UT  [SOT95P230X111-3N]
D606  PESD15VS2UT  [SOT95P230X111-3N]
D607  PESD15VS2UT  [SOT95P230X111-3N]
D608  PESD15VS2UT  [SOT95P230X111-3N]
R600  22R  [RESC1005X04N]
R601  22R  [RESC1005X04N]
R606  22R  [RESC1005X04N]
R607  22R  [RESC1005X04N]
TP600  AEMT-C00S-1000-0000  [TP100]  (value not drawn)
TP601  AEMT-C00S-1000-0000  [TP100]  (value not drawn)
TP602  AEMT-C00S-1000-0000  [TP100]  (value not drawn)
TP603  AEMT-C00S-1000-0000  [TP100]  (value not drawn)
U600  MAX3232EIPWR  [TSOP65P640X120-16N]
U602  MAX3232EIPWR  [TSOP65P640X120-16N]

### Ports
RS232_1_CTS (out), RS232_1_RTS (in), RS232_1_RX (in), RS232_1_RXD (out), RS232_1_TX (out), RS232_1_TXD (in), RS232_2_CTS (out), RS232_2_RTS (in), RS232_2_RX (in), RS232_2_RXD (out), RS232_2_TX (out), RS232_2_TXD (in), RS232_3_RX (in), RS232_3_TX (out), RS232_4_RX (in), RS232_4_TX (out)

### Nets
3V3: C601.2 C602.2 C607.2 C608.2 U600.16(VCC) U602.16(VCC)
GND: C602.1 C604.1 C608.1 C610.1 D600.1 D601.1 D602.1 D603.1 D605.1 D606.1 D607.1 D608.1 U600.15(GND) U602.15(GND)
RS232_1_CTS: R601.1 TP600.1 ; port RS232_1_CTS
RS232_1_RTS: TP602.1 U600.10(DIN2) ; port RS232_1_RTS
RS232_1_RX: D601.2 U600.13(RIN1) ; port RS232_1_RX
RS232_1_RXD: R600.1 TP601.1 ; port RS232_1_RXD
RS232_1_TX: D603.2 U600.14(DOUT1) ; port RS232_1_TX
RS232_1_TXD: TP603.1 U600.11(DIN1) ; port RS232_1_TXD
RS232_2_CTS: R607.1 ; port RS232_2_CTS
RS232_2_RTS: U602.10(DIN2) ; port RS232_2_RTS
RS232_2_RX: D600.2 U600.8(RIN2) ; port RS232_2_RX
RS232_2_RXD: R606.1 ; port RS232_2_RXD
RS232_2_TX: D602.2 U600.7(DOUT2) ; port RS232_2_TX
RS232_2_TXD: U602.11(DIN1) ; port RS232_2_TXD
RS232_3_RX: D606.2 U602.13(RIN1) ; port RS232_3_RX
RS232_3_TX: D608.2 U602.14(DOUT1) ; port RS232_3_TX
RS232_4_RX: D605.2 U602.8(RIN2) ; port RS232_4_RX
RS232_4_TX: D607.2 U602.7(DOUT2) ; port RS232_4_TX
NetC600_1: C600.1 U600.3(C1-)
NetC600_2: C600.2 U600.1(C1+)
NetC601_1: C601.1 U600.2(V+)
NetC603_1: C603.1 U600.5(C2-)
NetC603_2: C603.2 U600.4(C2+)
NetC604_2: C604.2 U600.6(V-)
NetC606_1: C606.1 U602.3(C1-)
NetC606_2: C606.2 U602.1(C1+)
NetC607_1: C607.1 U602.2(V+)
NetC609_1: C609.1 U602.5(C2-)
NetC609_2: C609.2 U602.4(C2+)
NetC610_2: C610.2 U602.6(V-)
NetR600_2: R600.2 U600.12(ROUT1)
NetR601_2: R601.2 U600.9(ROUT2)
NetR606_2: R606.2 U602.12(ROUT1)
NetR607_2: R607.2 U602.9(ROUT2)

Not connected (* = marked no-connect by the designer): D600 3*; D601 3*; D602 3*; D603 3*; D605 3*; D606 3*; D607 3*; D608 3*

### Notes on the sheet
- Alternatif Malzeme ST3232BTR
- Title
- Size:
- Date:
- A3
- Number:
- Time:
- Revision:
- Sheet
- of
- File:

### Library data of the parts
C600-C604 C606-C610 = ACC7-2100-S241-0000: as C406 on sheet Motor_Driver; Definition Date: 14.08.2012; Revision Date: *; Price: *; Supplier: *; Supplier Part Number: *; DS: 000049; Operating Temp: -55 to 125 C; Storage Temp: -55 to 125 C; Status: Active; Package Reference: EIA 0402, Metric 1005; Component Type: Capacitor; Footprint Type: SMD; Published by: MU; ESR: *; FR: *; Value: 100nF
D600-D603 D605-D608 = AS1H-950M-SI20-0000: Diode, TVS, ESD Protection, 15V, PESD15VS2UT, SOT-23; Manufacturer: NXP; CR: 451; DS: 000452; Lead Finish: Pb Free; Published by: MU; Requested by: NK; Price: *; Manufacturer Part Number: PESD15VS2UT; Definition Date: 11.12.2014; Footprint Type: SMD; JEDEC Code: *; Operating Temp: -65°C to 150°C; Package Reference: SOT-23; Revision Date: *; Status: Active; Storage Temp: -65°C to 150°C; Supplier: *; Supplier Part Number: *; Component Type: DIODE; Forward Voltage: *; Reverse Voltage: 15V; Value: PESD15VS2UT
R600 R601 R606 R607 = AR19-1220-S2B2-0000: RES, E24, Thick Film, SMD, 22R, 1%, 0.1W, 0402; Manufacturer: Panasonic; Manufacturer Part Number: ERJ-2RKF22R0X; CR: DS00073; Requested by: MU; Lead Finish: Pb Free; Max. Operating Voltage: 50V; Definition Date: 16.08.2012; Revision Date: *; Price: *; Supplier: *; Supplier Part Number: *; DS: DS00073; Operating Temp: -55 to 155 C; Storage Temp: -55 to 155 C; Status: Active; Package Reference: EIA 0402, Metric 1005; Component Type: Resistor; Footprint Type: SMD; Published by: MU; JEDEC Code: *; Material: Thick Film; ESR: *; FR: *; Power Rating: 0.1W; Value: 22R
TP600-TP603 = AEMT-C00S-1000-0000: as MH1 on sheet Main
U600 U602 = AT41-0000-SM90-0540: IC, Interface, RS232 Driver, MAX3232EIPWR, TSSOP-16; Manufacturer: Texas Instruments; Manufacturer Part Number: MAX3232EIPWRQ1; CR: 000008; Requested by: MAY; Lead Finish: Pb Free; Published by: OO; JEDEC Code: MO-187 AA; Definition Date: 18.04.2012; Price: 1.8; Supplier: *; Supplier Part Number: *; DS: 000008; Operating Temp: -40 to 85 C; Revision Date: 12.11.2012; Status: Active; Storage Temp: -65 to 150 C; Component Type: IC; Package Reference: TSSOP-16; Footprint Type: SMD; FR: *; Value: MAX3232EIPWR

## Sheet RS485_Interface.SchDoc
size A3; DocumentNumber: 4; SheetNumber: 4; SheetTotal: 11
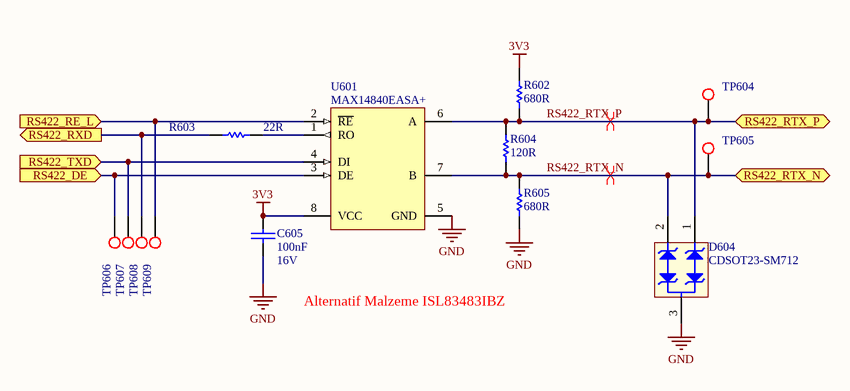
[diagram p3: RS485_Interface.SchDoc]

### Parts
C605  Operating Voltage: 16V  [CAPC1005X06N]  (hidden comment: 100nF)
D604  CDSOT23-SM712  [SOT95P230X117-3N]
R602  680R  [RESC1005X04N]
R603  22R  [RESC1005X04N]
R604  120R  [RESC1005X04N]
R605  680R  [RESC1005X04N]
TP604  AEMT-C00S-1000-0000  [TP100]  (value not drawn)
TP605  AEMT-C00S-1000-0000  [TP100]  (value not drawn)
TP606  AEMT-C00S-1000-0000  [TP100]  (value not drawn)
TP607  AEMT-C00S-1000-0000  [TP100]  (value not drawn)
TP608  AEMT-C00S-1000-0000  [TP100]  (value not drawn)
TP609  AEMT-C00S-1000-0000  [TP100]  (value not drawn)
U601  MAX14840EASA+  [SOIC127P600X175-8N]

### Ports
RS422_DE (in), RS422_RE_L (in), RS422_RTX_N (bidir), RS422_RTX_P (bidir), RS422_RXD (out), RS422_TXD (in)

### Nets
3V3: C605.1 R602.2 U601.8(VCC)
GND: C605.2 D604.3 R605.1 U601.5(GND)
RS422_DE: TP606.1 U601.3(DE) ; port RS422_DE
RS422_RE_L: TP609.1 U601.2(~{RE}) ; port RS422_RE_L
RS422_RTX_N: D604.2 R604.1 R605.2 TP605.1 U601.7(B) ; port RS422_RTX_N
RS422_RTX_P: D604.1 R602.1 R604.2 TP604.1 U601.6(A) ; port RS422_RTX_P
RS422_RXD: R603.1 TP608.1 ; port RS422_RXD
RS422_TXD: TP607.1 U601.4(DI) ; port RS422_TXD
NetR603_2: R603.2 U601.1(RO)

### Layout directives
differential pair: RS422_RTX_N, RS422_RTX_P

### Notes on the sheet
- Alternatif Malzeme ISL83483IBZ
- Title
- Size:
- Date:
- A3
- Number:
- Time:
- Revision:
- Sheet
- of
- File:

### Library data of the parts
C605 = ACC7-2100-S241-0000: as C406 on sheet Motor_Driver; Definition Date: 14.08.2012; Revision Date: *; Price: *; Supplier: *; Supplier Part Number: *; DS: 000049; Operating Temp: -55 to 125 C; Storage Temp: -55 to 125 C; Status: Active; Package Reference: EIA 0402, Metric 1005; Component Type: Capacitor; Footprint Type: SMD; Published by: MU; ESR: *; FR: *; Value: 100nF
D604 = AS1H-A17M-SI20-0000: Diode, TVS, 7V-12V, 400W, CDSOT23-SM712, SOT23; Manufacturer: Bourns; CR: 449; DS: 000450; Lead Finish: Pb Free; Published by: MU; Requested by: NK; Price: *; Manufacturer Part Number: CDSOT23-SM712; Definition Date: 11.12.2014; Footprint Type: SMD; JEDEC Code: *; Operating Temp: -55°C to 150°C; Package Reference: SOT23; Revision Date: *; Status: Active; Storage Temp: -55°C to 150°C; Supplier: *; Supplier Part Number: *; Component Type: DIODE; Forward Voltage: *; Reverse Voltage: 7V-12V; Value: CDSOT23-SM712
R602 R605 = AR19-2680-S2B2-0000: RES, E24, Thick Film, SMD, 680R, 1%, 0.1W, 0402; Manufacturer: Panasonic; Manufacturer Part Number: ERJ-2RKF6800X; CR: DS00073; Requested by: MU; Lead Finish: Pb Free; Max. Operating Voltage: 50V; Definition Date: 16.08.2012; Revision Date: *; Price: *; Supplier: *; Supplier Part Number: *; DS: DS00073; Operating Temp: -55 to 155 C; Storage Temp: -55 to 155 C; Status: Active; Package Reference: EIA 0402, Metric 1005; Component Type: Resistor; Footprint Type: SMD; Published by: MU; JEDEC Code: *; Material: Thick Film; ESR: *; FR: *; Power Rating: 0.1W; Value: 680R
R603 = AR19-1220-S2B2-0000: as R600 on sheet RS232_Interface; Definition Date: 16.08.2012; Revision Date: *; Price: *; Supplier: *; Supplier Part Number: *; DS: DS00073; Operating Temp: -55 to 155 C; Storage Temp: -55 to 155 C; Status: Active; Package Reference: EIA 0402, Metric 1005; Component Type: Resistor; Footprint Type: SMD; Published by: MU; JEDEC Code: *; Material: Thick Film; ESR: *; FR: *; Power Rating: 0.1W; Value: 22R
R604 = AR19-2120-S2B2-0000: RES, E24, Thick Film, SMD, 120R, 1%, 0.1W, 0402; Manufacturer: Panasonic; Manufacturer Part Number: ERJ-2RKF1200X; CR: DS00073; Requested by: MU; Lead Finish: Pb Free; Max. Operating Voltage: 50V; Definition Date: 16.08.2012; Revision Date: *; Price: *; Supplier: *; Supplier Part Number: *; DS: DS00073; Operating Temp: -55 to 155 C; Storage Temp: -55 to 155 C; Status: Active; Package Reference: EIA 0402, Metric 1005; Component Type: Resistor; Footprint Type: SMD; Published by: MU; JEDEC Code: *; Material: Thick Film; ESR: *; FR: *; Power Rating: 0.1W; Value: 120R
TP604-TP609 = AEMT-C00S-1000-0000: as MH1 on sheet Main
U601 = AT45-0000-SM50-1120: IC, Interface, Transceiver, RS-485 Half-Dublex, 3.3V, 40Mbps, MAX14840EASA+, SOIC-8; Manufacturer: MAXIM; CR: 175; DS: 000271; Requested by: NK; Lead Finish: Pb Free; Published by: IS; JEDEC Code: MO-012-AA; Revision Date: 13.08.2013; Supplier: *; Supplier Part Number: *; Storage Temp: -65°C to 150°C; Operating Temp: -40°C to 125°C; Definition Date: 01.07.2013; Price: *; Status: Active; Component Type: IC; Package Reference: SOIC-8; Footprint Type: SMD; Manufacturer Part Number: MAX14840EASA+; FR: *; Value: MAX14840EASA+